# EAGLE design fm_transmitter (EAGLE 7.2.0)
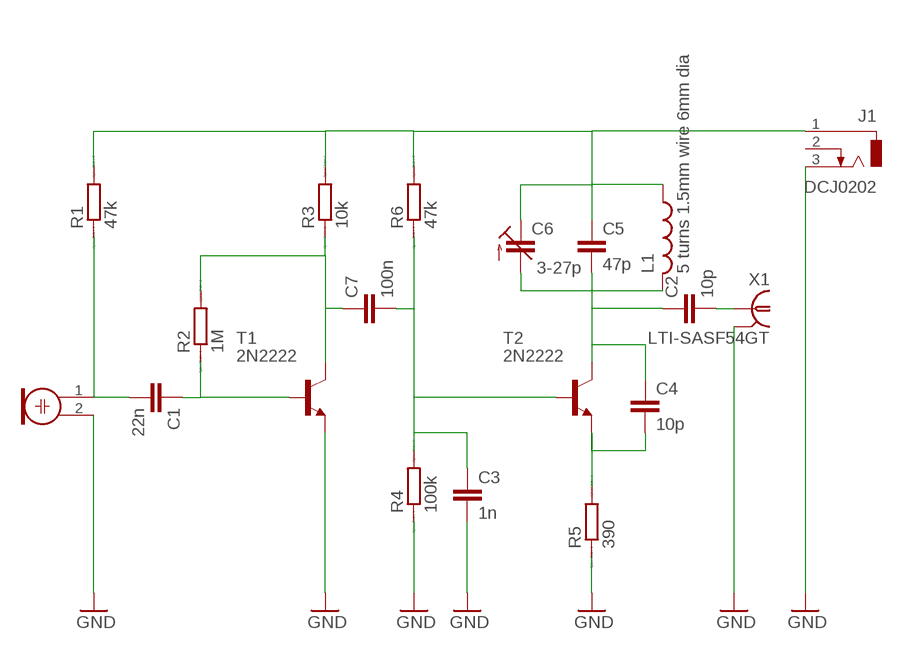
[diagram p0: schematic, sheet 1]

## Parts
C1  22n  C2.5/4  [C2.5-4]
C2  10p  C2.5/4  [C2.5-4]
C3  1n  C2.5/4  [C2.5-4]
C4  10p  C2.5/4  [C2.5-4]
C5  47p  C2.5/4  [C2.5-4]
C6  3-27p  C-TRIMM3008  [3008]
C7  100n  C2.5/4  [C2.5-4]
J1  DCJ0202  [DCJ0202]
L1  5 turns 1.5mm wire 6mm dia  L-US0207/7  [0207/7]
M1  ELECTRET_MICROPHON-F6050AP  [F6050AP]
R1  47k  R0207/10  [0207/10]
R2  1M  R0207/10  [0207/10]
R3  10k  R0207/10  [0207/10]
R4  100k  R0207/10  [0207/10]
R5  390  R0207/10  [0207/10]
R6  47k  R0207/10  [0207/10]
T1  2N2222  [TO18]
T2  2N2222  [TO18]
X1  LTI-SASF54GT  [LTI-SASF54GT]

## Nets
GND: C3.2 J1.3 M1.2 R4.1 R5.1 T1.1(E) X1.2 X1.3 X1.4 X1.5
N$1: C1.1 R2.1 T1.2(B)
N$2: C7.1 R2.2 R3.1 T1.3(C)
N$3: C1.2 M1.1 R1.1
N$4: C3.1 C7.2 R4.2 R6.1 T2.2(B)
N$6: C2.2 X1.1
N$7: C5.1 C6.+(E) J1.1 L1.1 R1.2 R3.2 R6.2
N$8: C2.1 C4.1 C5.2 C6.-(A) L1.2 T2.3(C)
N$10: C4.2 R5.2 T2.1(E)
Unconnected: J1.2

## Library data of the parts
C1-C5 C7 = capacitor-wima:C: CAPACITOR naming: grid - package width
C6 = c-trimm:C-TRIMM: Trimm capacitor; OC_FARNELL: unknown; OC_NEWARK: unknown
J1 = con-jack:DCJ0202: DC POWER JACK Source: DCJ0202.pdf; OC_FARNELL: unknown; OC_NEWARK: unknown
L1 = resistor:L-US: INDUCTOR, American symbol; DIAMETER: 6mm; TURNS: 5; WIRE: 1.5mm
M1 = microphon:ELECTRET_MICROPHON-: Electret Condenser Microphone
R1-R6 = eagle-ltspice:R: RESISTOR, European symbol; SPICEMODEL: NONE; SPICEPREFIX: R
T1 T2 = transistor:2N2222: NPN TRANSISTOR
X1 = con-coax:LTI-SASF54GT: SMA vertical PCB thrue hole jack Source: Lighthorse Technologies, inc. SASF54GT.pdf; OC_FARNELL: unknown; OC_NEWARK: unknown

## Board
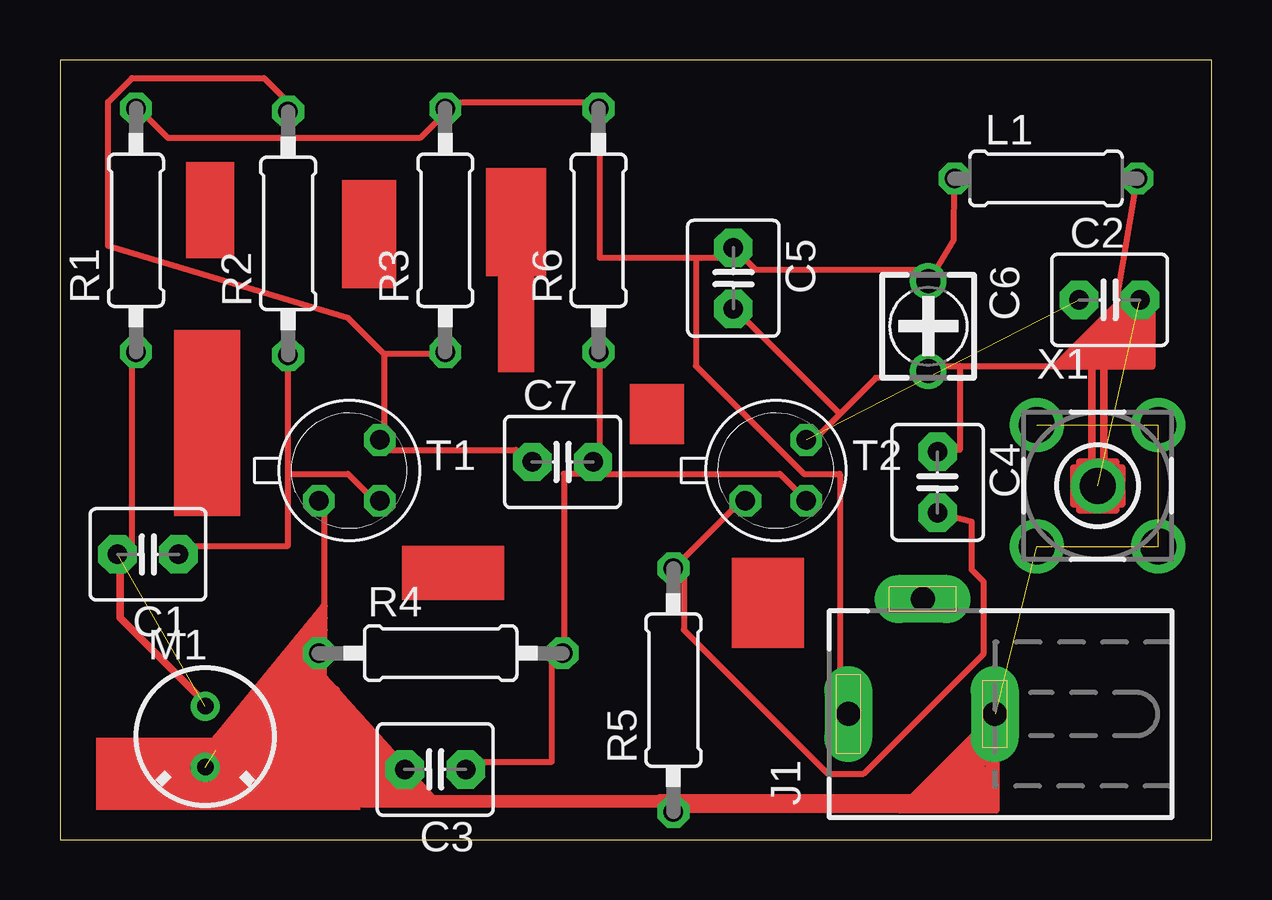
[diagram p1: board, top side]

Size 48 x 32.5 mm. Coordinates in mm from the lower left corner, seen from the top.
Outline: 0,0 48,0 48,32.5 0,32.5 0,0
Copper layers (1*16): Top 0.035mm / dielectric 1.5mm / Bottom 0.035mm
Design rules "default": minimum track width 10mil, minimum drill 24mil, track to track 8mil, track to pad 8mil, pad to pad 8mil, via to via 8mil, smd to smd 8mil, copper to edge 40mil, drill to drill 8mil, minimum pad ring 10mil, minimum via ring 8mil, stop-mask expansion 4mil, vias tented up to drill 0mil, thermal gap 10mil

### Footprints (pad centres in the part's own frame; a part is rotated, then mirrored left to right if it is on the bottom)
C2.5-4 = drill 0.813 pad 1.6 octagon: 1 -1.27,0; 2 1.27,0
3008 = drill 1: + -1.875,0; - 1.875,0
DCJ0202 = drill 1 pad 2 long: 1 0,3.1; 2 4.8,0; 3 0,-3
0207/7 = drill 0.813 octagon: 1 -3.81,0; 2 3.81,0
F6050AP = drill 0.7 pad 1.2: 1 0,1.27; 2 0,-1.27
0207/10 = drill 0.813 octagon: 1 -5.08,0; 2 5.08,0
TO18 = drill 0.813 octagon: 1 -1.27,-1.27; 2 1.27,-1.27; 3 1.27,1.27
LTI-SASF54GT = drill 1.5 pad 2.2: 1 0,0; 2 -2.54,2.54; 3 2.54,2.54; 4 2.54,-2.54; 5 -2.54,-2.54

### Placement (x,y rotation side)
C1  3.67,11.89 180 top
C2  43.75,22.5 0 top
C3  15.64,2.92 180 top
C4  36.58,14.89 270 top
C5  28.07,23.4 270 top
C6  36.19,21.4 270 top
C7  20.95,15.74 0 top
J1  35.96,5.23 90 top
L1  41.1,27.56 0 top
M1  6.06,4.29 0 top
R1  3.17,25.4 90 top
R2  9.51,25.27 90 top
R3  16.06,25.4 90 top
R4  15.87,7.77 0 top
R5  25.57,6.23 90 top
R6  22.45,25.4 90 top
T1  12.06,15.39 0 top
T2  29.84,15.39 0 top
X1  43.25,14.75 0 top

### Tracks (layer width: path | path; a pad name or v marks a point on that pad's centre or on a via)
GND  (5 unrouted)
  Top 0.254: T1.1 11,13.75 11,9.75 11,9.25 11,8.75 11,8.25 R4.1 11,7.75 11,6.75 11,6.25 11,5.75 11,5.25 11,3.25 13,3.25 14,3.25 C3.2 14.5,2.75 | 15.5,1.75 25,1.75 25.5,1.25 R5.1 26,1.25 35,1.25 | 35.5,1.75 38.5,4.75 J1.3
  Top 0.305: 15.5,1.75 14.5,2.75 | 14.5,2.75 14,3.25 | 13.5,2.75 13.5,1.75 | 13.5,1.75 15,1.75 | 13,1.75 13.5,1.75 | 14,3.25 15,1.75 | 15,1.75 15.5,1.75 | 15.5,1.75 14,2.75 | 14,2.75 14.5,2.25 | 15.5,1.75 11,6.75 | 11,6.25 11.5,5.75 | 11.5,5.75 14,3.25 | 14.5,2.75 14,2.75 | 14,2.75 11,5.75 13.5,2.75 | 13.5,2.75 13,3.25 | 13,3.25 11.5,4.75 | 11.5,4.75 11,5.25 | 11,5.25 11.5,3.75 13,3.25 | 13,3.25 11.5,4.25 11.5,4.75 | 6.5,4.25 11,9.75 10,8.25 | 10,8.25 7,3.75 10.5,7.75 10,7.25 | 10,7.25 9,6.25 | 9,6.25 6.5,3.75 10,8.25 | 10,8.25 11,9.25 9.5,7.25 10.5,8.25 9,6.25 | 9,6.25 11,8.75 10,7.25 | 10,7.25 11,7.75 10,6.75 11,8.25 10.5,3.75 11.5,5.75 | 11.5,5.75 14,2.75 | 14,2.75 11,6.25 | 11,6.25 11.5,6.25 10,3.75 11,5.25 | 39,4.75 39,4.25 | 39,4.25 39,3.75 | 39,3.75 39,3.25 | 39,3.25 39,2.75 | 39,2.75 39,2.25 | 39,2.25 39,1.75 | 35,1.25 35.5,1.25 | 35.5,1.25 36,1.25 | 36,1.25 36.5,1.25 | 36.5,1.25 37,1.25 | 37,1.25 37.5,1.25 | 37.5,1.25 38.5,1.25 | 38.5,1.25 39,1.25 | 39,1.25 38.5,4.75 39,4.75 | 38.5,4.25 39,4.25 | 39,4.25 38.5,3.75 | 38.5,3.75 39,3.75 | 39,3.75 38.5,1.25 | 38.5,1.25 39,1.75 | 39,1.75 35.5,1.25 | 35.5,1.25 38,2.25 38.5,1.25 | 38.5,1.25 37.5,1.75 37,1.75 | 37,1.75 35.5,1.25 | 35.5,1.25 36,1.75 | 36,1.75 38,3.75 | 38,3.75 38.5,4.25 | 38.5,4.25 35,1.25 | 39,5.25 39,4.75 | 38.5,3.75 37,2.25 | 37,2.25 36,1.25 | 36,1.25 39,4.75 | 39,4.75 38.5,4.25 | 35.5,1.25 39,3.75 | 39,3.75 37,1.75 | 37,1.75 36.5,1.25 | 36.5,1.25 39,3.25 | 39,3.25 37,1.25 | 37,1.25 39,2.75 | 39,2.75 37.5,1.25 | 37.5,1.25 39,2.25 | 39,2.25 37,2.25 | 37,2.25 37,1.75 | 37,1.75 38,3.75 | 38,3.75 39,5.25 | 39,5.25 35.5,1.75 | 35.5,1.75 35,1.25 | 35,1.25 36,1.75 | 36,1.75 35.5,1.75 | 35.5,1.75 25.5,1.75 | 25.5,1.75 25,1.75 25.5,1.5 | 25.5,1.5 26,1.25 35.5,1.75
  Top 0.305: 35.5,1.75 35.5,1.25 | 35.5,1.25 25.5,1.75 | 25.5,1.75 39,1.25 | 39,1.25 39,1.75 | 39,1.75 25.5,1.5
N$1
  Top 0.254: 9.5,15.25 9.5,12.25 5,12.25 C1.1 | 9.5,15.25 9.5,19.75 R2.1 | 9.5,15.25 12,15.25 13,14.25 T1.2
N$2
  Top 0.254: 13.5,20.25 13.5,16.75 T1.3 13.5,16.25 19,16.25 19.5,15.75 C7.1 | 13.5,20.25 16,20.25 R3.1 | 13.5,20.25 12,21.75 2,24.75 2,30.75 3,31.75 8.5,31.75 9.5,30.75 R2.2
N$3  (1 unrouted)
  Top 0.254: R1.1 3,20.25 3,12.25 2.5,12.25 C1.2
N$4
  Top 0.254: C3.1 17,3.25 20.5,3.25 20.5,7.75 R4.2 21,8.25 21,15.25 22,15.25 C7.2 | R6.1 22.5,20.25 22.5,15.75 C7.2 | T2.2 31,14.25 30,15.25 22.5,15.25 C7.2
N$5
  Top 0.305: 2.5,11.75 2.5,9.25 6,5.75 6,5.5
N$6  (1 unrouted)
N$7
  Top 0.254: R1.2 3.5,30.25 4.5,29.25 15,29.25 16,30.25 R3.2 16.5,30.75 22,30.75 R6.2 22.5,30.25 22.5,24.25 26.5,24.25 | L1.1 37.25,25 36.5,23.75 C6.+ 36,23.75 29,23.75 28.5,24.25 C5.1 28,24.25 26.5,24.25 | 26.5,24.25 26.5,19.75 31,15.25 32.5,15.25 32.5,5.25 J1.1
N$8  (1 unrouted)
  Top 0.254: 32.5,17.75 34,19.25 36,19.25 C6.- 36.5,19.75 37.5,19.75 | 32.5,17.75 31.5,16.75 T2.3 | 37.5,19.75 41.5,19.75 43.5,21.75 44,22.25 L1.2 | 32.5,17.75 28.5,21.75 C5.2 | 37.5,19.75 37.5,16.25 C4.1
  Top 0.305: 42.75,19.75 41.5,19.75 44.5,22.75 | 42.75,19.75 42,20 44,21.75 | 42.75,20 42,19.75 | 42,19.75 43,20.75 | 43,20.75 43.5,21.25 43.5,20.75 | 43.5,20.75 43.5,20.25 | 43,20.75 43.5,20.75 | 42,19.75 43.5,21.75 | 43.5,21.75 44,21.75 | 44,21.75 44.5,22.25 43.5,21.75 | 44,21.75 43,19.75 | 43,19.75 43.5,19.75 | 43.5,19.75 45.25,19.75 | 44.5,22 44.25,21.75 44.5,22.75 | 44.5,22.75 44.75,22.75 | 44.75,22.75 45.25,22.25 45.25,22.5 | 45.25,19.75 45.25,20 | 45.25,20 45.25,20.25 | 45.25,20.25 45.25,22.75 | 45.25,22.75 44.75,22.75 | 44.75,22.75 44.75,20.75 44.5,20.75 | 45.25,20.25 44.75,20 45.25,20 | 45.25,20 42.75,19.75 | 42.75,19.75 43,19.75 | 45.25,19.75 45.5,19.75 45.5,22.75 45.25,22.75 | 43.5,19.75 43.5,13.75 | 43.25,20 43,19.75 | 43,19.75 43,13.75 | 43,13.75 43.5,13.75 | 43.5,13.75 43.75,13.75 | 43.75,13.75 43.75,14 | 43.75,14 44,14 | 44,14 44,14.25 44.25,14.25 | 44.25,14.25 44.25,15.5 42.25,15.5 42.25,14 42.5,14 | 42.5,14 42.5,13.75 | 42.5,13.75 43,13.75 | 43.75,13.75 44,13.75 44,15.75 42.5,15.75 42.5,14 | 42.5,13.75 43.75,14 | 44,14 44.25,14 | 44.25,14 44.25,14.25 | 42.5,14 43.75,14 | 44.25,14 43.75,14.25 43.75,15.25 42.75,15.25 42.75,14.25
N$9
  Top 0.305: 12.25,1.5 26.75,1.5 10.75,1.75
N$10
  Top 0.254: T2.1 28.5,13.75 28,13.75 26,11.75 R5.2 26,11.25 26,8.75 32,2.75 33.5,2.75 38.5,7.75 38.5,10.75 38,11.25 38,13.25 C4.2
N$11
  Top 0.305: 9.5,5.75 9.5,7 9,6.5
N$12
  Top 0.305: 5.25,2.25 5.25,2.75
(copper drawn outside any net)
  shapes: Top area x23

### Text on the board
tRestrict: Daniel Robinson / FM transmitter / v1